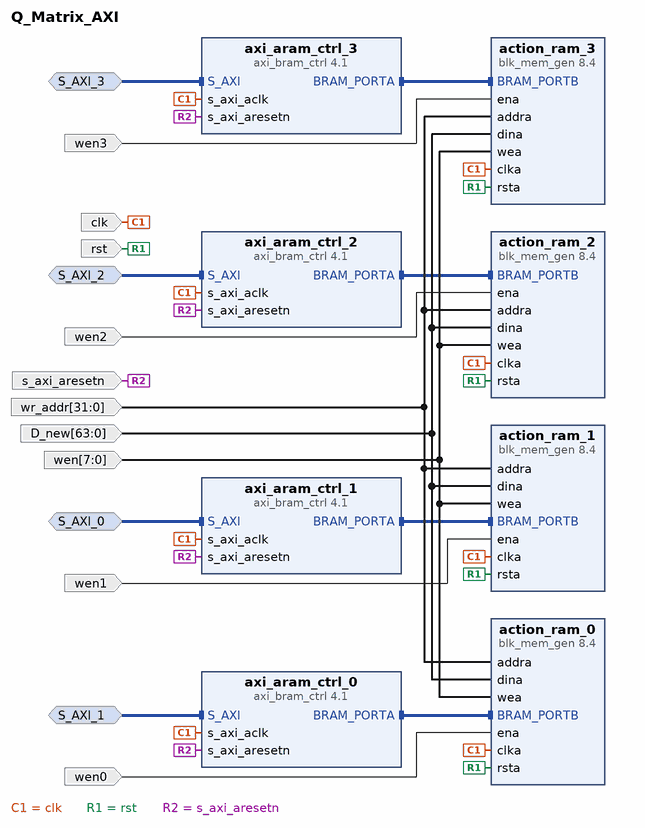
[diagram p0: block diagram of the top level]
# Vivado block design Q_Matrix_AXI, xc7z020clg400-1, Vivado 2022.1
create_bd_design Q_Matrix_AXI

create_bd_intf_port -mode Slave -vlnv xilinx.com:interface:aximm_rtl:1.0 S_AXI_0
set_property -dict [list \
  CONFIG.ADDR_WIDTH 15 \
  CONFIG.ARUSER_WIDTH 0 \
  CONFIG.AWUSER_WIDTH 0 \
  CONFIG.BUSER_WIDTH 0 \
  CONFIG.DATA_WIDTH 32 \
  CONFIG.HAS_BRESP 1 \
  CONFIG.HAS_BURST 1 \
  CONFIG.HAS_CACHE 1 \
  CONFIG.HAS_LOCK 1 \
  CONFIG.HAS_PROT 1 \
  CONFIG.HAS_QOS 0 \
  CONFIG.HAS_REGION 0 \
  CONFIG.HAS_RRESP 1 \
  CONFIG.HAS_WSTRB 1 \
  CONFIG.ID_WIDTH 0 \
  CONFIG.MAX_BURST_LENGTH 256 \
  CONFIG.NUM_READ_OUTSTANDING 2 \
  CONFIG.NUM_READ_THREADS 1 \
  CONFIG.NUM_WRITE_OUTSTANDING 2 \
  CONFIG.NUM_WRITE_THREADS 1 \
  CONFIG.PROTOCOL AXI4 \
  CONFIG.READ_WRITE_MODE READ_WRITE \
  CONFIG.RUSER_BITS_PER_BYTE 0 \
  CONFIG.RUSER_WIDTH 0 \
  CONFIG.SUPPORTS_NARROW_BURST 1 \
  CONFIG.WUSER_BITS_PER_BYTE 0 \
  CONFIG.WUSER_WIDTH 0 \
] [get_bd_intf_ports S_AXI_0]
create_bd_intf_port -mode Slave -vlnv xilinx.com:interface:aximm_rtl:1.0 S_AXI_1
set_property -dict [list \
  CONFIG.ADDR_WIDTH 15 \
  CONFIG.ARUSER_WIDTH 0 \
  CONFIG.AWUSER_WIDTH 0 \
  CONFIG.BUSER_WIDTH 0 \
  CONFIG.DATA_WIDTH 32 \
  CONFIG.HAS_BRESP 1 \
  CONFIG.HAS_BURST 1 \
  CONFIG.HAS_CACHE 1 \
  CONFIG.HAS_LOCK 1 \
  CONFIG.HAS_PROT 1 \
  CONFIG.HAS_QOS 0 \
  CONFIG.HAS_REGION 0 \
  CONFIG.HAS_RRESP 1 \
  CONFIG.HAS_WSTRB 1 \
  CONFIG.ID_WIDTH 0 \
  CONFIG.MAX_BURST_LENGTH 256 \
  CONFIG.NUM_READ_OUTSTANDING 2 \
  CONFIG.NUM_READ_THREADS 1 \
  CONFIG.NUM_WRITE_OUTSTANDING 2 \
  CONFIG.NUM_WRITE_THREADS 1 \
  CONFIG.PROTOCOL AXI4 \
  CONFIG.READ_WRITE_MODE READ_WRITE \
  CONFIG.RUSER_BITS_PER_BYTE 0 \
  CONFIG.RUSER_WIDTH 0 \
  CONFIG.SUPPORTS_NARROW_BURST 1 \
  CONFIG.WUSER_BITS_PER_BYTE 0 \
  CONFIG.WUSER_WIDTH 0 \
] [get_bd_intf_ports S_AXI_1]
create_bd_intf_port -mode Slave -vlnv xilinx.com:interface:aximm_rtl:1.0 S_AXI_2
set_property -dict [list \
  CONFIG.ADDR_WIDTH 15 \
  CONFIG.ARUSER_WIDTH 0 \
  CONFIG.AWUSER_WIDTH 0 \
  CONFIG.BUSER_WIDTH 0 \
  CONFIG.DATA_WIDTH 32 \
  CONFIG.HAS_BRESP 1 \
  CONFIG.HAS_BURST 1 \
  CONFIG.HAS_CACHE 1 \
  CONFIG.HAS_LOCK 1 \
  CONFIG.HAS_PROT 1 \
  CONFIG.HAS_QOS 0 \
  CONFIG.HAS_REGION 0 \
  CONFIG.HAS_RRESP 1 \
  CONFIG.HAS_WSTRB 1 \
  CONFIG.ID_WIDTH 0 \
  CONFIG.MAX_BURST_LENGTH 256 \
  CONFIG.NUM_READ_OUTSTANDING 2 \
  CONFIG.NUM_READ_THREADS 1 \
  CONFIG.NUM_WRITE_OUTSTANDING 2 \
  CONFIG.NUM_WRITE_THREADS 1 \
  CONFIG.PROTOCOL AXI4 \
  CONFIG.READ_WRITE_MODE READ_WRITE \
  CONFIG.RUSER_BITS_PER_BYTE 0 \
  CONFIG.RUSER_WIDTH 0 \
  CONFIG.SUPPORTS_NARROW_BURST 1 \
  CONFIG.WUSER_BITS_PER_BYTE 0 \
  CONFIG.WUSER_WIDTH 0 \
] [get_bd_intf_ports S_AXI_2]
create_bd_intf_port -mode Slave -vlnv xilinx.com:interface:aximm_rtl:1.0 S_AXI_3
set_property -dict [list \
  CONFIG.ADDR_WIDTH 15 \
  CONFIG.ARUSER_WIDTH 0 \
  CONFIG.AWUSER_WIDTH 0 \
  CONFIG.BUSER_WIDTH 0 \
  CONFIG.DATA_WIDTH 32 \
  CONFIG.HAS_BRESP 1 \
  CONFIG.HAS_BURST 1 \
  CONFIG.HAS_CACHE 1 \
  CONFIG.HAS_LOCK 1 \
  CONFIG.HAS_PROT 1 \
  CONFIG.HAS_QOS 0 \
  CONFIG.HAS_REGION 0 \
  CONFIG.HAS_RRESP 1 \
  CONFIG.HAS_WSTRB 1 \
  CONFIG.ID_WIDTH 0 \
  CONFIG.MAX_BURST_LENGTH 256 \
  CONFIG.NUM_READ_OUTSTANDING 2 \
  CONFIG.NUM_READ_THREADS 1 \
  CONFIG.NUM_WRITE_OUTSTANDING 2 \
  CONFIG.NUM_WRITE_THREADS 1 \
  CONFIG.PROTOCOL AXI4 \
  CONFIG.READ_WRITE_MODE READ_WRITE \
  CONFIG.RUSER_BITS_PER_BYTE 0 \
  CONFIG.RUSER_WIDTH 0 \
  CONFIG.SUPPORTS_NARROW_BURST 1 \
  CONFIG.WUSER_BITS_PER_BYTE 0 \
  CONFIG.WUSER_WIDTH 0 \
] [get_bd_intf_ports S_AXI_3]
create_bd_port -dir I -from 63 -to 0 D_new
create_bd_port -dir I -type clk clk
create_bd_port -dir I -type rst rst
create_bd_port -dir I -from 7 -to 0 wen
create_bd_port -dir I wen0
create_bd_port -dir I wen1
create_bd_port -dir I wen2
create_bd_port -dir I wen3
create_bd_port -dir I -from 31 -to 0 wr_addr
create_bd_port -dir I -type rst s_axi_aresetn

create_bd_cell -type ip -vlnv xilinx.com:ip:blk_mem_gen:8.4 action_ram_0
set_property -dict [list \
  CONFIG.Assume_Synchronous_Clk true \
  CONFIG.EN_SAFETY_CKT true \
  CONFIG.Enable_32bit_Address true \
  CONFIG.Enable_B Use_ENB_Pin \
  CONFIG.Memory_Type True_Dual_Port_RAM \
  CONFIG.Operating_Mode_A WRITE_FIRST \
  CONFIG.Operating_Mode_B WRITE_FIRST \
  CONFIG.Port_B_Clock 100 \
  CONFIG.Port_B_Enable_Rate 100 \
  CONFIG.Port_B_Write_Rate 50 \
  CONFIG.Read_Width_A 64 \
  CONFIG.Read_Width_B 64 \
  CONFIG.Register_PortA_Output_of_Memory_Primitives false \
  CONFIG.Register_PortB_Output_of_Memory_Primitives false \
  CONFIG.Use_RSTA_Pin true \
  CONFIG.Use_RSTB_Pin true \
  CONFIG.Write_Width_A 64 \
  CONFIG.Write_Width_B 64 \
  CONFIG.use_bram_block BRAM_Controller \
] [get_bd_cells action_ram_0]
create_bd_cell -type ip -vlnv xilinx.com:ip:blk_mem_gen:8.4 action_ram_1
set_property -dict [list \
  CONFIG.Assume_Synchronous_Clk true \
  CONFIG.EN_SAFETY_CKT true \
  CONFIG.Enable_32bit_Address true \
  CONFIG.Enable_B Use_ENB_Pin \
  CONFIG.Memory_Type True_Dual_Port_RAM \
  CONFIG.Operating_Mode_A WRITE_FIRST \
  CONFIG.Operating_Mode_B WRITE_FIRST \
  CONFIG.Port_B_Clock 100 \
  CONFIG.Port_B_Enable_Rate 100 \
  CONFIG.Port_B_Write_Rate 50 \
  CONFIG.Read_Width_A 64 \
  CONFIG.Read_Width_B 64 \
  CONFIG.Register_PortA_Output_of_Memory_Primitives false \
  CONFIG.Register_PortB_Output_of_Memory_Primitives false \
  CONFIG.Use_RSTA_Pin true \
  CONFIG.Use_RSTB_Pin true \
  CONFIG.Write_Width_A 64 \
  CONFIG.Write_Width_B 64 \
  CONFIG.use_bram_block BRAM_Controller \
] [get_bd_cells action_ram_1]
create_bd_cell -type ip -vlnv xilinx.com:ip:blk_mem_gen:8.4 action_ram_2
set_property -dict [list \
  CONFIG.Assume_Synchronous_Clk true \
  CONFIG.EN_SAFETY_CKT true \
  CONFIG.Enable_32bit_Address true \
  CONFIG.Enable_B Use_ENB_Pin \
  CONFIG.Memory_Type True_Dual_Port_RAM \
  CONFIG.Operating_Mode_A WRITE_FIRST \
  CONFIG.Operating_Mode_B WRITE_FIRST \
  CONFIG.Port_B_Clock 100 \
  CONFIG.Port_B_Enable_Rate 100 \
  CONFIG.Port_B_Write_Rate 50 \
  CONFIG.Read_Width_A 64 \
  CONFIG.Read_Width_B 64 \
  CONFIG.Register_PortA_Output_of_Memory_Primitives false \
  CONFIG.Register_PortB_Output_of_Memory_Primitives false \
  CONFIG.Use_RSTA_Pin true \
  CONFIG.Use_RSTB_Pin true \
  CONFIG.Write_Width_A 64 \
  CONFIG.Write_Width_B 64 \
  CONFIG.use_bram_block BRAM_Controller \
] [get_bd_cells action_ram_2]
create_bd_cell -type ip -vlnv xilinx.com:ip:blk_mem_gen:8.4 action_ram_3
set_property -dict [list \
  CONFIG.Assume_Synchronous_Clk true \
  CONFIG.EN_SAFETY_CKT true \
  CONFIG.Enable_32bit_Address true \
  CONFIG.Enable_B Use_ENB_Pin \
  CONFIG.Memory_Type True_Dual_Port_RAM \
  CONFIG.Operating_Mode_A WRITE_FIRST \
  CONFIG.Operating_Mode_B WRITE_FIRST \
  CONFIG.Port_B_Clock 100 \
  CONFIG.Port_B_Enable_Rate 100 \
  CONFIG.Port_B_Write_Rate 50 \
  CONFIG.Read_Width_A 64 \
  CONFIG.Read_Width_B 64 \
  CONFIG.Register_PortA_Output_of_Memory_Primitives false \
  CONFIG.Register_PortB_Output_of_Memory_Primitives false \
  CONFIG.Use_RSTA_Pin true \
  CONFIG.Use_RSTB_Pin true \
  CONFIG.Write_Width_A 64 \
  CONFIG.Write_Width_B 64 \
  CONFIG.use_bram_block BRAM_Controller \
] [get_bd_cells action_ram_3]
create_bd_cell -type ip -vlnv xilinx.com:ip:axi_bram_ctrl:4.1 axi_aram_ctrl_1
set_property -dict {CONFIG.SINGLE_PORT_BRAM 1} [get_bd_cells axi_aram_ctrl_1]
create_bd_cell -type ip -vlnv xilinx.com:ip:axi_bram_ctrl:4.1 axi_aram_ctrl_2
set_property -dict {CONFIG.SINGLE_PORT_BRAM 1} [get_bd_cells axi_aram_ctrl_2]
create_bd_cell -type ip -vlnv xilinx.com:ip:axi_bram_ctrl:4.1 axi_aram_ctrl_3
set_property -dict {CONFIG.SINGLE_PORT_BRAM 1} [get_bd_cells axi_aram_ctrl_3]
create_bd_cell -type ip -vlnv xilinx.com:ip:axi_bram_ctrl:4.1 axi_aram_ctrl_0
set_property -dict {CONFIG.SINGLE_PORT_BRAM 1} [get_bd_cells axi_aram_ctrl_0]

# ---- connections ----

connect_bd_intf_net -intf_net S_AXI_0_1 [get_bd_intf_ports S_AXI_0] [get_bd_intf_pins axi_aram_ctrl_1/S_AXI]
connect_bd_intf_net -intf_net S_AXI_1_1 [get_bd_intf_ports S_AXI_1] [get_bd_intf_pins axi_aram_ctrl_0/S_AXI]
connect_bd_intf_net -intf_net S_AXI_2_1 [get_bd_intf_ports S_AXI_2] [get_bd_intf_pins axi_aram_ctrl_2/S_AXI]
connect_bd_intf_net -intf_net S_AXI_3_1 [get_bd_intf_ports S_AXI_3] [get_bd_intf_pins axi_aram_ctrl_3/S_AXI]
connect_bd_intf_net [get_bd_intf_pins axi_aram_ctrl_0/BRAM_PORTA] [get_bd_intf_pins action_ram_0/BRAM_PORTB]
connect_bd_intf_net [get_bd_intf_pins axi_aram_ctrl_1/BRAM_PORTA] [get_bd_intf_pins action_ram_1/BRAM_PORTB]
connect_bd_intf_net [get_bd_intf_pins axi_aram_ctrl_2/BRAM_PORTA] [get_bd_intf_pins action_ram_2/BRAM_PORTB]
connect_bd_intf_net [get_bd_intf_pins axi_aram_ctrl_3/BRAM_PORTA] [get_bd_intf_pins action_ram_3/BRAM_PORTB]
connect_bd_net -net addra_0_1 [get_bd_ports wr_addr] \
  [get_bd_pins action_ram_0/addra] [get_bd_pins action_ram_1/addra] [get_bd_pins action_ram_2/addra] \
  [get_bd_pins action_ram_3/addra]
connect_bd_net -net clka_0_1 [get_bd_ports clk] \
  [get_bd_pins action_ram_0/clka] [get_bd_pins action_ram_1/clka] [get_bd_pins action_ram_2/clka] \
  [get_bd_pins action_ram_3/clka] [get_bd_pins axi_aram_ctrl_1/s_axi_aclk] [get_bd_pins axi_aram_ctrl_2/s_axi_aclk] \
  [get_bd_pins axi_aram_ctrl_3/s_axi_aclk] [get_bd_pins axi_aram_ctrl_0/s_axi_aclk]
connect_bd_net -net dina_0_1 [get_bd_ports D_new] \
  [get_bd_pins action_ram_0/dina] [get_bd_pins action_ram_1/dina] [get_bd_pins action_ram_2/dina] \
  [get_bd_pins action_ram_3/dina]
connect_bd_net -net rsta_0_1 [get_bd_ports rst] \
  [get_bd_pins action_ram_0/rsta] [get_bd_pins action_ram_1/rsta] [get_bd_pins action_ram_2/rsta] \
  [get_bd_pins action_ram_3/rsta]
connect_bd_net -net s_axi_aresetn_0_1 [get_bd_ports s_axi_aresetn] \
  [get_bd_pins axi_aram_ctrl_1/s_axi_aresetn] [get_bd_pins axi_aram_ctrl_2/s_axi_aresetn] \
  [get_bd_pins axi_aram_ctrl_3/s_axi_aresetn] [get_bd_pins axi_aram_ctrl_0/s_axi_aresetn]
connect_bd_net -net wea_0_1 [get_bd_ports wen] \
  [get_bd_pins action_ram_0/wea] [get_bd_pins action_ram_1/wea] [get_bd_pins action_ram_2/wea] [get_bd_pins action_ram_3/wea]
connect_bd_net -net wen0_1 [get_bd_ports wen0] [get_bd_pins action_ram_0/ena]
connect_bd_net -net wen1_1 [get_bd_ports wen1] [get_bd_pins action_ram_1/ena]
connect_bd_net -net wen2_1 [get_bd_ports wen2] [get_bd_pins action_ram_2/ena]
connect_bd_net -net wen3_1 [get_bd_ports wen3] [get_bd_pins action_ram_3/ena]

# ---- address map ----
assign_bd_address -offset 0x0000 -range 4K -target_address_space [get_bd_addr_spaces S_AXI_0] [get_bd_addr_segs axi_aram_ctrl_1/S_AXI/Mem0]
assign_bd_address -offset 0x0000 -range 4K -target_address_space [get_bd_addr_spaces S_AXI_1] [get_bd_addr_segs axi_aram_ctrl_0/S_AXI/Mem0]
assign_bd_address -offset 0x0000 -range 4K -target_address_space [get_bd_addr_spaces S_AXI_2] [get_bd_addr_segs axi_aram_ctrl_2/S_AXI/Mem0]
assign_bd_address -offset 0x0000 -range 4K -target_address_space [get_bd_addr_spaces S_AXI_3] [get_bd_addr_segs axi_aram_ctrl_3/S_AXI/Mem0]

validate_bd_design
save_bd_design
